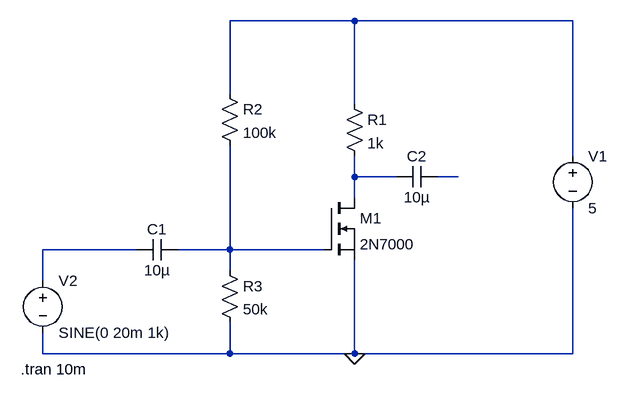
[diagram p0: schematic Common-sourse_amplifier.asc]
Common-sourse_amplifier.asc, the LTspice schematic file:
Version 4
SHEET 1 880 680
WIRE -368 -80 -560 -80
WIRE -32 -80 -368 -80
WIRE -560 32 -560 -80
WIRE -368 48 -368 -80
WIRE -32 128 -32 -80
WIRE -368 160 -368 128
WIRE -304 160 -368 160
WIRE -208 160 -240 160
WIRE -368 192 -368 160
WIRE -704 272 -848 272
WIRE -560 272 -560 112
WIRE -560 272 -640 272
WIRE -416 272 -560 272
WIRE -560 304 -560 272
WIRE -848 320 -848 272
WIRE -848 432 -848 400
WIRE -560 432 -560 384
WIRE -560 432 -848 432
WIRE -368 432 -368 288
WIRE -368 432 -560 432
WIRE -32 432 -32 208
WIRE -32 432 -368 432
FLAG -368 432 0
SYMBOL voltage -32 112 R0
WINDOW 123 0 0 Left 0
WINDOW 39 0 0 Left 0
SYMATTR InstName V1
SYMATTR Value 5
SYMBOL res -384 32 R0
SYMATTR InstName R1
SYMATTR Value 1k
SYMBOL nmos -416 192 R0
SYMATTR InstName M1
SYMATTR Value 2N7000
SYMBOL cap -640 256 R90
WINDOW 0 0 32 VBottom 2
WINDOW 3 32 32 VTop 2
SYMATTR InstName C1
SYMATTR Value 10µ
SYMBOL voltage -848 304 R0
WINDOW 123 0 0 Left 0
WINDOW 39 0 0 Left 0
SYMATTR InstName V2
SYMATTR Value SINE(0 20m 1k)
SYMBOL res -576 16 R0
SYMATTR InstName R2
SYMATTR Value 100k
SYMBOL res -576 288 R0
SYMATTR InstName R3
SYMATTR Value 50k
SYMBOL cap -240 144 R90
WINDOW 0 0 32 VBottom 2
WINDOW 3 32 32 VTop 2
SYMATTR InstName C2
SYMATTR Value 10µ
TEXT -882 456 Left 2 !.tran 10m

The netlist it stands for:
* Common-sourse_amplifier.asc
V1 N001 0 5
R1 N001 N002 1k
M1 N002 N005 0 0 2N7000
C1 N005 N004 10µ
V2 N004 0 SINE(0 20m 1k)
R2 N001 N005 100k
R3 N005 0 50k
C2 N003 N002 10µ
.model NMOS NMOS
.model PMOS PMOS
.lib standard.mos
.tran 10m
.backanno
.end